# Altium schematic sheet [04] - REVISION HISTORY.SchDoc
size A3; DocumentNumber: 4; SheetNumber: 4; SheetTotal: 5
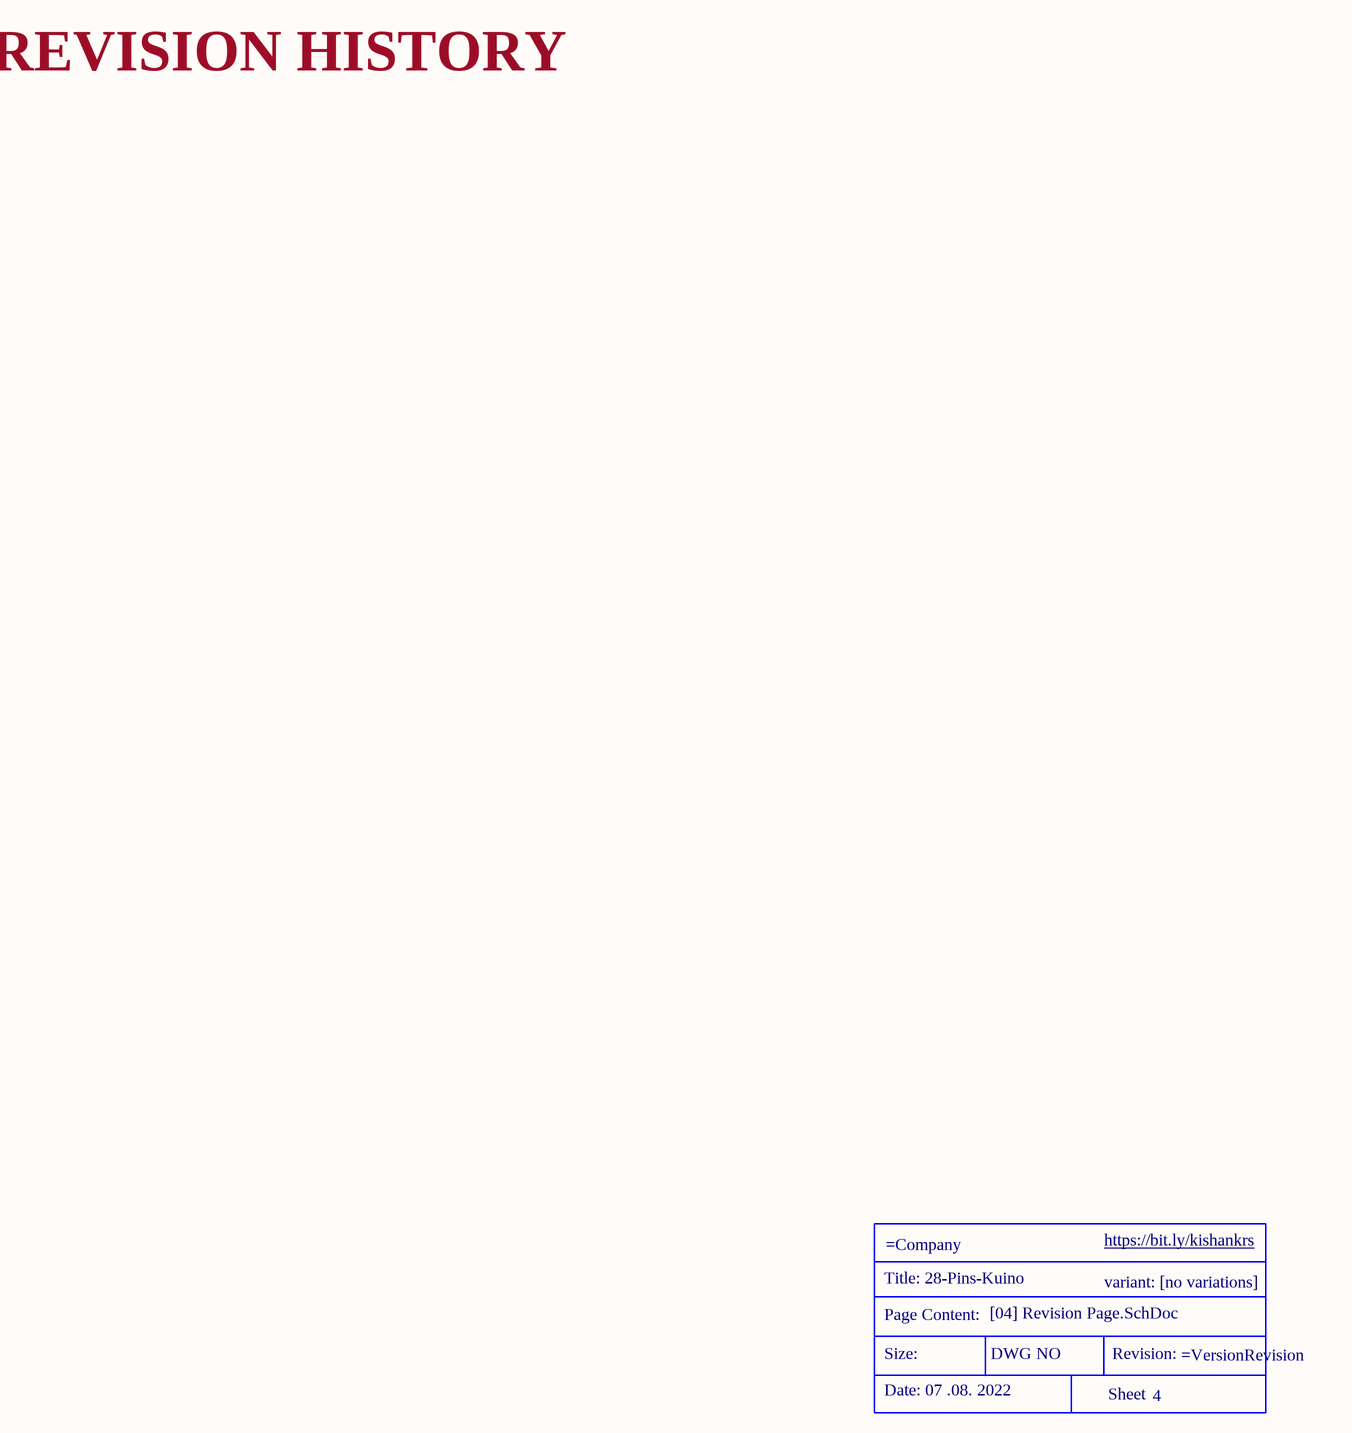
[diagram p0: [04] - REVISION HISTORY.SchDoc]

## Parts
*  Title Block-REV  (value not drawn)  (graphical)

## Notes on the sheet
- REVISION HISTORY
- (in symbol Title Block-REV) https://bit.ly/kishankrs; Title: 28-Pins-Kuino; variant: [no variations]; Page Content:; [04] Revision Page.SchDoc; Size:; DWG NO; Revision:; Date: 07 .08. 2022; Sheet

## Library data of the parts
* = Title Block-REV: Title Block-Revision page